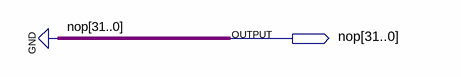
[diagram p0: schematic sheet]
// Quartus schematic instruction_nop.bdf as structural Verilog: 0 symbols, 1 pins
module instruction_nop (
  output [31:0] nop
);


  assign nop = {32{1'b0}};
endmodule
